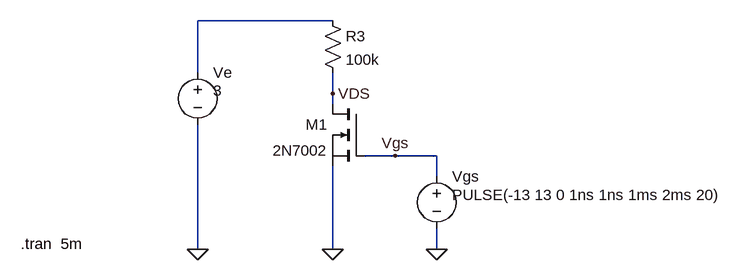
[diagram p0: schematic Transistor_Commutation.asc]
Transistor_Commutation.asc, the LTspice schematic file:
Version 4
SHEET 1 964 680
WIRE -48 -400 -256 -400
WIRE -256 -320 -256 -400
WIRE -48 -288 -48 -320
WIRE -48 -272 -48 -288
WIRE 48 -192 0 -192
WIRE 112 -192 48 -192
WIRE 112 -160 112 -192
WIRE -256 -48 -256 -240
WIRE -48 -48 -48 -176
WIRE 112 -48 112 -80
FLAG 112 -48 0
FLAG -48 -48 0
FLAG -256 -48 0
FLAG 48 -192 Vgs
FLAG -48 -288 VDS
SYMBOL voltage 112 -176 R0
WINDOW 3 24 44 Left 2
WINDOW 123 0 0 Left 2
WINDOW 39 0 0 Left 2
SYMATTR Value PULSE(-13 13 0 1ns 1ns 1ms 2ms 20)
SYMATTR InstName Vgs
SYMBOL nmos 0 -272 M0
SYMATTR InstName M1
SYMATTR Value 2N7002
SYMBOL res -64 -416 R0
SYMATTR InstName R3
SYMATTR Value 100k
SYMBOL voltage -256 -336 R0
WINDOW 123 0 0 Left 2
WINDOW 39 0 0 Left 2
WINDOW 3 24 44 Left 2
SYMATTR InstName Ve
SYMATTR Value 3
TEXT -528 -56 Left 2 !.tran  5m

The netlist it stands for:
* Transistor_Commutation.asc
Vgs Vgs 0 PULSE(-13 13 0 1ns 1ns 1ms 2ms 20)
M1 VDS Vgs 0 0 2N7002
R3 N001 VDS 100k
Ve N001 0 3
.model NMOS NMOS
.model PMOS PMOS
.lib standard.mos
.tran  5m
.backanno
.end